# EAGLE design pcb_4 (EAGLE 4.16)
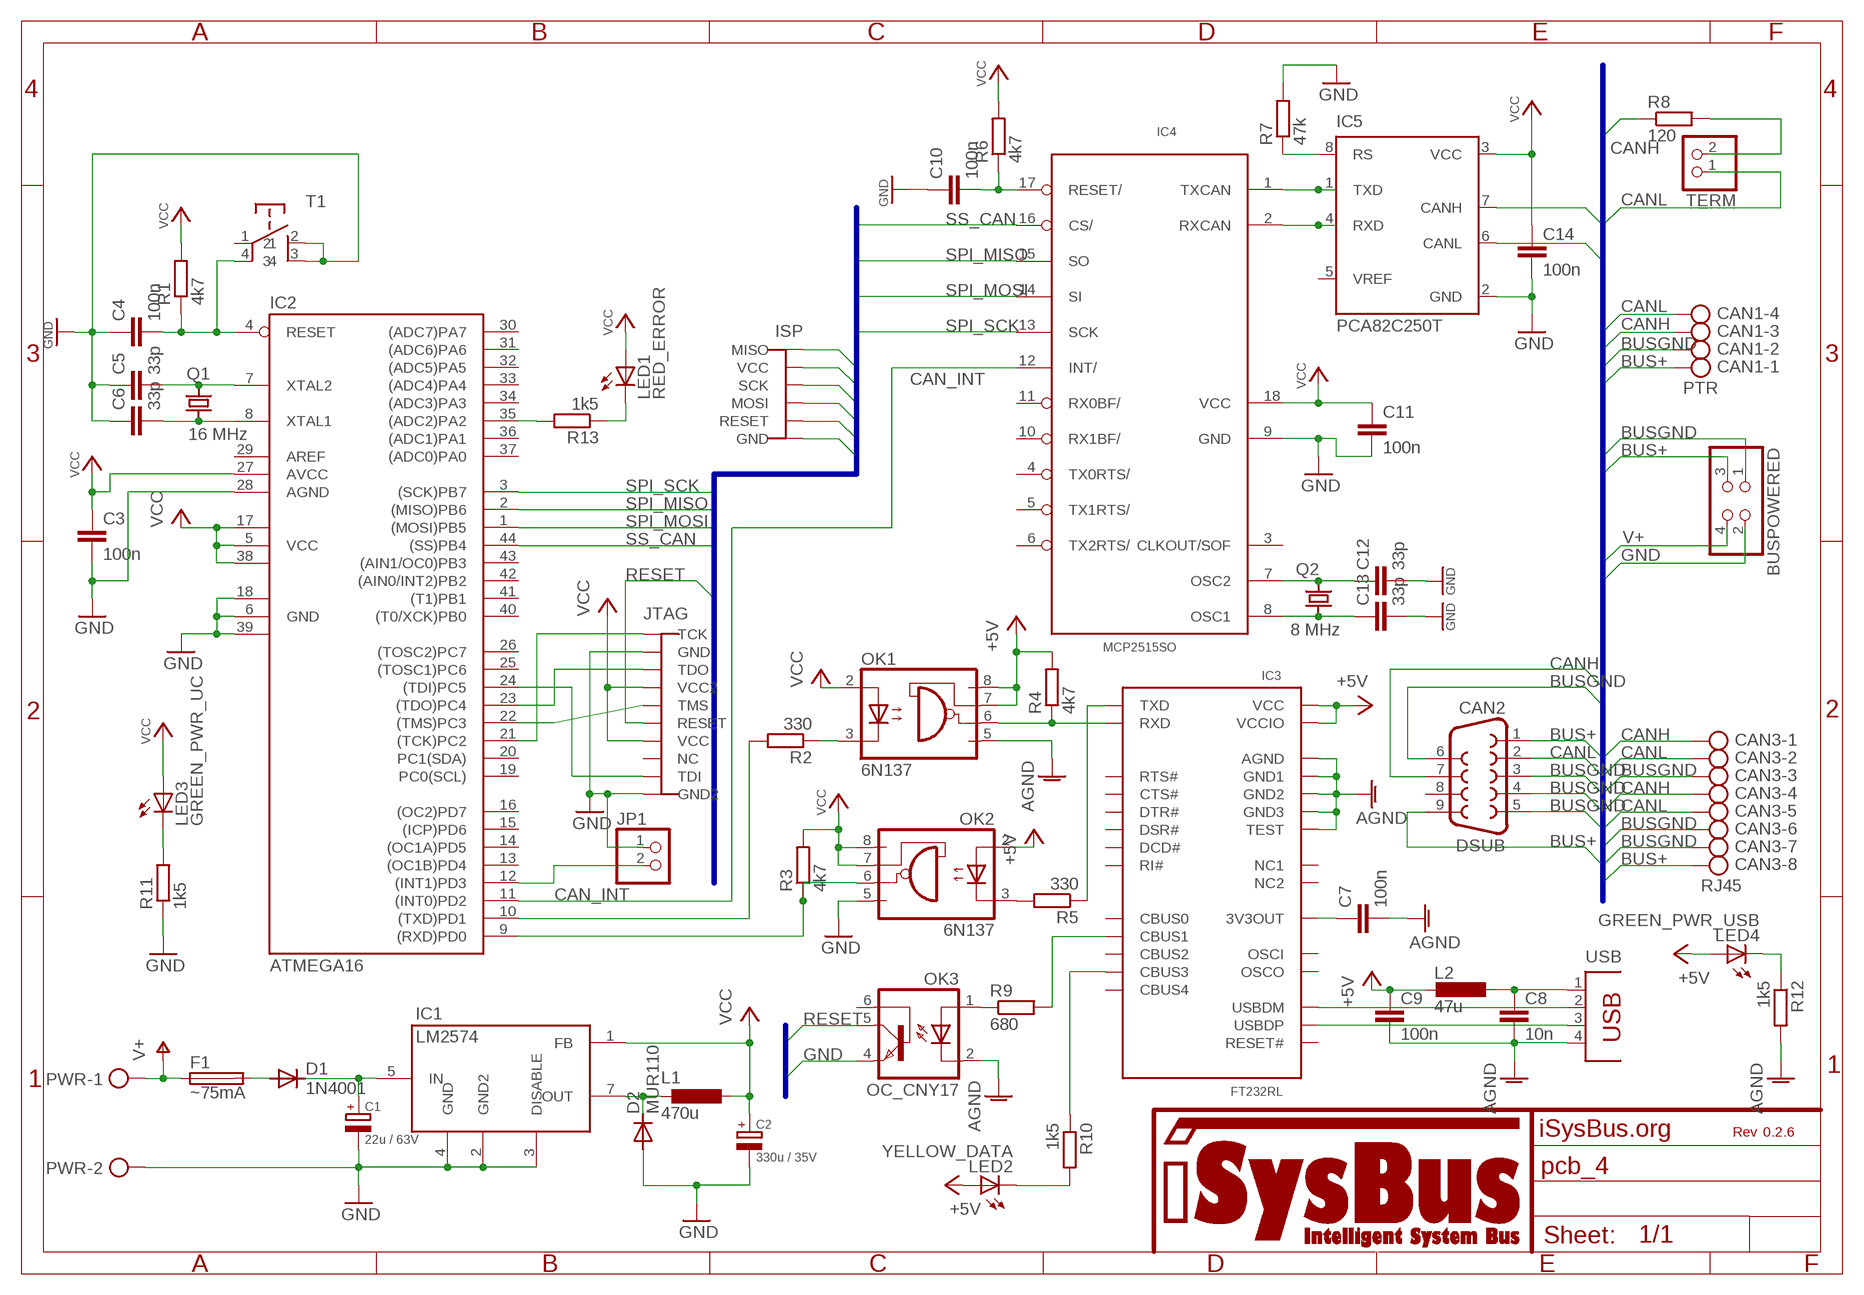
[diagram p0: schematic, sheet 1]

## Parts
BUSPOWERED  PINHD-2X2  [2X02]
C1  22u / 63V  C-IN-LM2574  [C-IN]
C2  330u / 35V  C-OUT-LM2574  [C-OUT]
C3  100n  C-EUC0805  [C0805]
C4  100n  C-EUC0805  [C0805]
C5  33p  C-EUC0805  [C0805]
C6  33p  C-EUC0805  [C0805]
C7  100n  C-EUC0805  [C0805]
C8  10n  C-EUC0805  [C0805]
C9  100n  C-EUC0805  [C0805]
C10  100n  C-EUC0805  [C0805]
C11  100n  C-EUC0805  [C0805]
C12  33p  C-EUC0805  [C0805]
C13  33p  C-EUC0805  [C0805]
C14  100n  C-EUC0805  [C0805]
CAN1  PTR  CON_AKL230-4  [AKL230-4]
CAN2  DSUB  F09HP  [F09HP]
CAN3  RJ45  CON_RJ45  [RJ45]
D1  1N4001  DIODE_1N4001  [DO41-10]
D2  MUR110  DIODE_MUR110  [DO41-10]
F1  ~75mA  FUSE_5MM  [19560]
IC1  LM2574  SUP_LM2574-DIL8  [DIL08]
IC2  ATMEGA16  UC_ATMEGA16-A  [TQFP44]
IC3  FT232RL  USB_FT232RL  [SSOP-28]
IC4  MCP2515SO  CAN_MCP2515SO  [SO18L]
IC5  PCA82C250T  CAN_PCA82C250T  [SO08N.PAC]
ISP  CON_ISP1  [057-006-1]
JP1  PIN1X2  [1X02]
JTAG  CON_JTAG1  [057-010-1]
L1  470u  L-LM2574  [L5-10]
L2  47u  L-EU0207/10  [0207/10]
LED1  RED_ERROR  LED3MM  [LED3MM]
LED2  YELLOW_DATA  LED3MM  [LED3MM]
LED3  GREEN_PWR_UC  LED3MM  [LED3MM]
LED4  GREEN_PWR_USB  LED3MM  [LED3MM]
OK1  6N137  OK_6N137  [DIL08@1]
OK2  6N137  OK_6N137  [DIL08@1]
OK3  OC_CNY17  [DIL06]
PWR  CON_AKL230-2  [AKL230-2]
Q1  16 MHz  CRYSTAL  [HC49U-V]
Q2  8 MHz  CRYSTAL  [HC49U-V]
R1  4k7  R-EU_R0805  [R0805]
R2  330  R-EU_R0805  [R0805]
R3  4k7  R-EU_R0805  [R0805]
R4  4k7  R-EU_R0805  [R0805]
R5  330  R-EU_R0805  [R0805]
R6  4k7  R-EU_R0805  [R0805]
R7  47k  R-EU_R0805  [R0805]
R8  120  R-EU_R0805  [R0805]
R9  680  R-EU_R0805  [R0805]
R10  1k5  R-EU_R0805  [R0805]
R11  1k5  R-EU_R0805  [R0805]
R12  1k5  R-EU_R0805  [R0805]
R13  1k5  R-EU_R0805  [R0805]
T1  SWITCH_PHAP3301  [PHAP3301]
TERM  PINHD-1X2  [1X02]
U$1  ISYSBUS_LOGO  [ISYSBUS_LOGO]
U$2  0.2.6  FIELD_REVISION_ISYSBUS  [FIELD_REVISION_ISYSBUS]
U$3  FIELD_NAME  [FIELD_NAME]
USB  CON_USB  [PN61729]

## Nets
+3V3: C9.1 IC3.P$4(VCCIO) IC3.P$20(VCC) L2.2 LED2.A LED4.A OK1.7(VE) OK1.8(VCC) OK2.2(A) R4.2 ; supply symbol labelled +5V
AGND: C7.2 C8.2 C9.2 IC3.P$7(GND1) IC3.P$18(GND2) IC3.P$21(GND3) IC3.P$25(AGND) IC3.P$26(TEST) OK1.5(GND) OK3.2(C) R12.2 USB.4
BUS+: BUSPOWERED.3 CAN1.1 CAN2.1 CAN2.9 CAN3.8
BUSGND: BUSPOWERED.1 CAN1.2 CAN2.3 CAN2.4 CAN2.5 CAN2.6 CAN3.3 CAN3.6 CAN3.7
CAN_INT: IC2.11((INT0)PD2) IC4.12(INT/)
CANH: CAN1.3 CAN2.7 CAN3.1 CAN3.4 IC5.7(CANH) R8.1
CANL: CAN1.4 CAN2.2 CAN3.2 CAN3.5 IC5.6(CANL) TERM.1
GND: BUSPOWERED.2 C1.- C2.- C3.2 C4.1 C5.1 C6.1 C10.1 C11.2 C12.2 C13.2 C14.2 D2.A IC1.2(GND2) IC1.3(DISABLE) IC1.4(GND) IC2.6(GND) IC2.18(GND1) IC2.28(AGND) IC2.39(GND2) IC4.9(GND) IC5.2(GND) ISP.6(GND) JP1.1 JTAG.2(GND) JTAG.10(GND2) OK2.5(GND) OK3.4(EMI) PWR.2 R7.2 R11.1 T1.2 T1.3
N$1: C7.1 IC3.P$17(3V3OUT)
N$2: C6.2 IC2.8(XTAL1) Q1.1
N$3: C5.2 IC2.7(XTAL2) Q1.2
N$4: C1.+ D1.C IC1.5(IN)
N$5: OK2.3(C) R5.2
N$6: OK1.3(C) R2.1
N$7: IC2.9((RXD)PD0) OK2.6(VO) R3.1
N$8: R8.2 TERM.2
N$9: C10.2 IC4.17(RESET/) R6.1
N$10: C12.1 IC4.7(OSC2) Q2.2
N$11: C13.1 IC4.8(OSC1) Q2.1
N$12: IC3.P$5(RXD) OK1.6(VO) R4.1
N$13: D1.A F1.2
N$14: IC5.8(RS) R7.1
N$15: IC3.P$22(CBUS1) R9.2
N$16: OK3.1(A) R9.1
N$17: IC2.35((ADC2)PA2) R13.2
N$18: LED1.K(C) R13.1
N$19: LED2.K(C) R10.2
N$20: IC3.P$14(CBUS3) R10.1
N$21: LED4.K(C) R12.1
N$22: LED3.K(C) R11.2
N$23: IC2.12((INT1)PD3) JP1.2
REG_OUT: D2.C IC1.7(OUT) L1.P$2
RESET: C4.2 IC2.4(RESET) ISP.5(RESET) JTAG.6(RESET) OK3.5(COL) R1.1 T1.4
RXCAN: IC4.1(TXCAN) IC5.1(TXD)
SPI_MISO: IC2.2((MISO)PB6) IC4.15(SO) ISP.1(MISO)
SPI_MOSI: IC2.1((MOSI)PB5) IC4.14(SI) ISP.4(MOSI)
SPI_SCK: IC2.3((SCK)PB7) IC4.13(SCK) ISP.3(SCK)
SS_CAN: IC2.44((SS)PB4) IC4.16(CS/)
TCK: IC2.21((TCK)PC2) JTAG.1(TCK)
TDI: IC2.24((TDI)PC5) JTAG.9(TDI)
TDO: IC2.23((TDO)PC4) JTAG.3(TDO)
TMS: IC2.22((TMS)PC3) JTAG.5(TMS)
TXCAN: IC4.2(RXCAN) IC5.4(RXD)
UART_RXD: IC3.P$1(TXD) R5.1
UART_TXD: IC2.10((TXD)PD1) R2.2
USB_1: C8.1 L2.1 USB.1
USB_DM: IC3.P$16(USBDM) USB.2
USB_DP: IC3.P$15(USBDP) USB.3
V+: BUSPOWERED.4 F1.1 PWR.1
VCC: C2.+ C3.1 C11.1 C14.1 IC1.1(FB) IC2.5(VCC) IC2.17(VCC1) IC2.27(AVCC) IC2.38(VCC2) IC4.18(VCC) IC5.3(VCC) ISP.2(VCC) JTAG.4(VCC2) JTAG.7(VCC) L1.P$1 LED1.A LED3.A OK1.2(A) OK2.7(VE) OK2.8(VCC) R1.2 R3.2 R6.2
Unconnected: CAN2.8 IC2.13((OC1B)PD4) IC2.14((OC1A)PD5) IC2.15((ICP)PD6) IC2.16((OC2)PD7) IC2.19(PC0(SCL)) IC2.20(PC1(SDA)) IC2.25((TOSC1)PC6) IC2.26((TOSC2)PC7) IC2.30((ADC7)PA7) IC2.31((ADC6)PA6) IC2.32((ADC5)PA5) IC2.33((ADC4)PA4) IC2.34((ADC3)PA3) IC2.36((ADC1)PA1) IC2.37((ADC0)PA0) IC2.40((T0/XCK)PB0) IC2.41((T1)PB1) IC2.42((AIN0/INT2)PB2) IC2.43((AIN1/OC0)PB3) IC3.P$2(DTR#) IC3.P$3(RTS#) IC3.P$6(RI#) IC3.P$8(NC1) IC3.P$9(DSR#) IC3.P$10(DCD#) IC3.P$11(CTS#) IC3.P$12(CBUS4) IC3.P$13(CBUS2) IC3.P$19(RESET#) IC3.P$23(CBUS0) IC3.P$24(NC2) IC3.P$27(OSCI) IC3.P$28(OSCO) IC4.3(CLKOUT/SOF) IC4.4(TX0RTS/) IC4.5(TX1RTS/) IC4.6(TX2RTS/) IC4.10(RX1BF/) IC4.11(RX0BF/) IC5.5(VREF) JTAG.8(NC) OK3.6(BAS) T1.1

## Buses
SPI_MISO,SPI_MOSI,SPI_SCK,SS_CAN,RESET,VCC,GND
CANH,CANL,V+,GND,BUS+,BUSGND
RESET,GND

## Power pins joined to a net without a drawn wire
AREF: IC2.29(AREF)

## Library data of the parts
BUSPOWERED = pinhead:PINHD-2X2: PIN HEADER
C1 = isysbus_passive:C-IN-LM2574: Capacitor: Input for LM2574 Order numbers: - Reichelt: RAD 22/63 - CSD-Electronics: ???
C2 = isysbus_passive:C-OUT-LM2574: Capacitor: Output for LM2574 Order numbers: - Reichelt: RAD 330/35 - CSD-Electronics: 1204
C3-C14 = rcl:C-EU: CAPACITOR, European symbol
CAN1 = isysbus_mechanical:CON_AKL230-4: Connector: AKL230-4 Order numbers: - Reichelt: AKL 230-04 - CSD-Electronics: N/A
CAN2 = con-subd:F09: SUB-D
CAN3 = isysbus_mechanical:CON_RJ45: Connector: 8pin RJ45 Order numbers: - Reichelt: MEBP 8-8G - CSD-Electronics: 015-5402
D1 = isysbus_active:DIODE_1N4001: Diode: 1N4001 Order numbers: - Reichelt: 1N 4001 - CSD-Electronics: 11001
D2 = isysbus_active:DIODE_MUR110: Diode: MUR110 Order numbers: - Reichelt: MUR 110 - CSD-Electronics: N/A
F1 = isysbus_mechanical:FUSE_5MM: Fuse holder Order numbers: - Reichelt: PL 166600 - CSD-Electronics: N/A
IC1 = isysbus_ics:SUP_LM2574: Voltage regulator: LM2574 Order numbers (DIP8): - Reichelt: LM 2574 N5 - CSD-Electronics: N/A Order numbers (SO14WM): - Reichelt: N/A - CSD-Electronics: N/A
IC2 = isysbus_ics:UC_ATMEGA16: Microcontroller: ATmega16 Order numbers (TQFP44): - Reichelt: ATMEGA 16-16 TQ - CSD-Electronics: 30139
IC3 = isysbus_ics:USB_FT232RL: USB-USART adapter: FT232RL Order numbers (SSOP28): - Reichelt: FT 232 RL - CSD-Electronics: N/A
IC4 = isysbus_ics:CAN_MCP2515*: CAN-Controller: MCP2515 Order numbers (DIP18): - Reichelt: MCP 2515-I/P - CSD-Electronics: N/A Order numbers (SO18): - Reichelt: MCP 2515-I/SO - CSD-Electronics: N/A
IC5 = isysbus_ics:CAN_PCA82C250: CAN-Transceiver: PCA82C250 / MCP2551 Order numbers (DIP8): - Reichelt: PCA 82C250 - CSD-Electronics: N/A Order numbers (SO8): - Reichelt: PCA 82C250 T - CSD-Electronics: N/A
ISP = isysbus_mechanical:CON_ISP: Connector: ISP Order numbers: - Reichelt: N/A - CSD-Electronics: N/A
JP1 = isysbus_mechanical:PIN1X2: PIN HEADER
JTAG = isysbus_mechanical:CON_JTAG: Connector: JTAG Order numbers: - Reichelt: WSL 10G - CSD-Electronics: 01550
L1 = isysbus_passive:L-LM2574: Inductor: for LM2574 Order numbers: - Reichelt: 09P 470µ - CSD-Electronics: ???
L2 = rcl:L-EU: INDUCTOR, European symbol
LED1-LED4 = led:LED: LED OSRAM: - CHIPLED LG R971, LG N971, LY N971, LG Q971, LY Q971, LO R971, LY R971 LH N974, LH R974 LS Q976, LO Q976, LY Q976 LO Q996 - Hyper CHIPLED LW Q18S LB Q993, LB Q99A, LB R99A - SideLED LS A670, LO A670, LY A670, LG A670, LP A670 LB A673, LV A673, LT A673, LW A673 LH A674 LY A675 LS A676, LA A676, LO A676, LY A676, LW A676 LS A679, LY A679, LG A679 - Hyper Micro SIDELED® LS Y876, LA Y876, LO Y876, LY Y876 LT Y87S - SmartLED LW L88C, LW L88S LB L89C, LB L89S, LG L890 LS L89K, LO L89K, LY L89K LS L896, LA L896, LO L896, LY L896 - TOPLED LS T670, LO T670, LY T670, LG T670, LP T670 LSG T670, LSP T670, LSY T670, LOP T670, LYG T670 LG T671, LOG T671, LSG T671 LB T673, LV T673, LT T673, LW T673 LH T674 LS T676, LA T676, LO T676, LY T676, LB T676, LH T676, LSB T676, LW T676 LB T67C, LV T67C, LT T67C, LS T67K, LO T67K, LY T67K, LW E67C LS E67B, LA E67B, LO E67B, LY E67B, LB E67C, LV E67C, LT E67C LW T67C LS T679, LY T679, LG T679 LS T770, LO T770, LY T770, LG T770, LP T770 LB T773, LV T773, LT T773, LW T773 LH T774 LS E675, LA E675, LY E675, LS T675 LS T776, LA T776, LO T776, LY T776, LB T776 LHGB T686 LT T68C, LB T68C - Hyper Mini TOPLED® LB M676 - Mini TOPLED Santana® LG M470 LS M47K, LO M47K, LY M47K Source: http://www.osram.convergy.de - LUMILED® LXK2-PW12-R00, LXK2-PW12-S00, LXK2-PW14-U00, LXK2-PW14-V00 LXK2-PM12-R00, LXK2-PM12-S00, LXK2-PM14-U00 LXK2-PE12-Q00, LXK2-PE12-R00, LXK2-PE12-S00, LXK2-PE14-T00, LXK2-PE14-U00 LXK2-PB12-K00, LXK2-PB12-L00, LXK2-PB12-M00, LXK2-PB14-N00, LXK2-PB14-P00, LXK2-PB14-Q00 LXK2-PR12-L00, LXK2-PR12-M00, LXK2-PR14-Q00, LXK2-PR14-R00 LXK2-PD12-Q00, LXK2-PD12-R00, LXK2-PD12-S00 LXK2-PH12-R00, LXK2-PH12-S00 LXK2-PL12-P00, LXK2-PL12-Q00, LXK2-PL12-R00 Source: www.luxeon.com
OK1 OK2 = isysbus_ics:OK_6N137: MOTOROLA OPTO COUPLER
OK3 = isysbus_ics:OC_CNY17: Optocoupler: CNY17 Order numbers (DIP6): - Reichelt: CNY 17/I - CSD-Electronics: 13117
PWR = isysbus_mechanical:CON_AKL230-2: Connector: AKL230-2 Order numbers: - Reichelt: AKL 230-02 - CSD-Electronics: N/A
Q1 Q2 = isysbus_passive:CRYSTAL: Crystal: HC49U
R1-R13 = rcl:R-EU_: RESISTOR, European symbol
T1 = isysbus_mechanical:SWITCH_PHAP3301: Switch: PHAP3301 Order numbers: - Reichelt: TASTER 3301 - CSD-Electronics: ? 35102 ?
TERM = pinhead:PINHD-1X2: PIN HEADER
U$1 = isysbus_misc:ISYSBUS_LOGO: iSysBus Logo
U$2 = isysbus_misc:FIELD_REVISION_ISYSBUS
U$3 = isysbus_misc:FIELD_NAME
USB = isysbus_mechanical:CON_USB: Connector: USB Type B Order numbers: - Reichelt: USB BW - CSD-Electronics: 1575

## Board
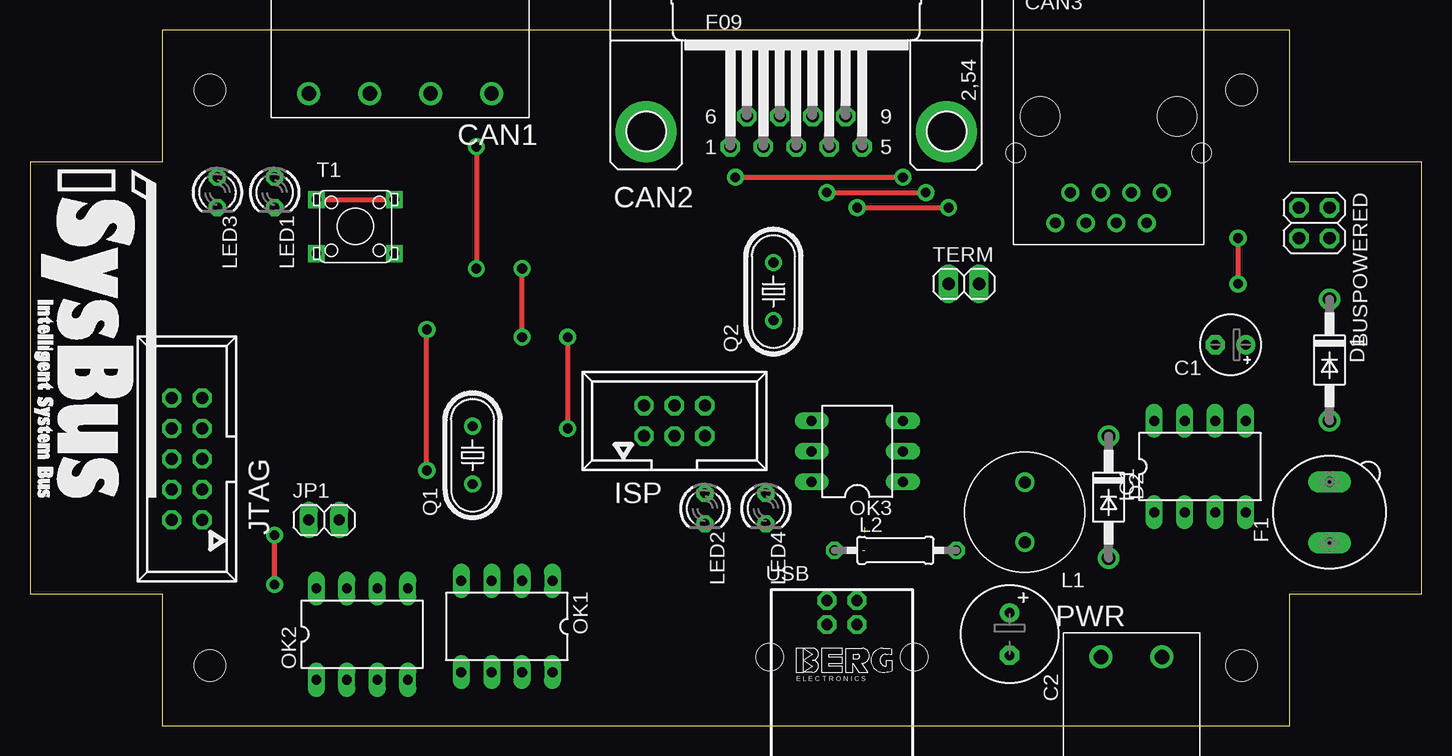
[diagram p1: board, top side]
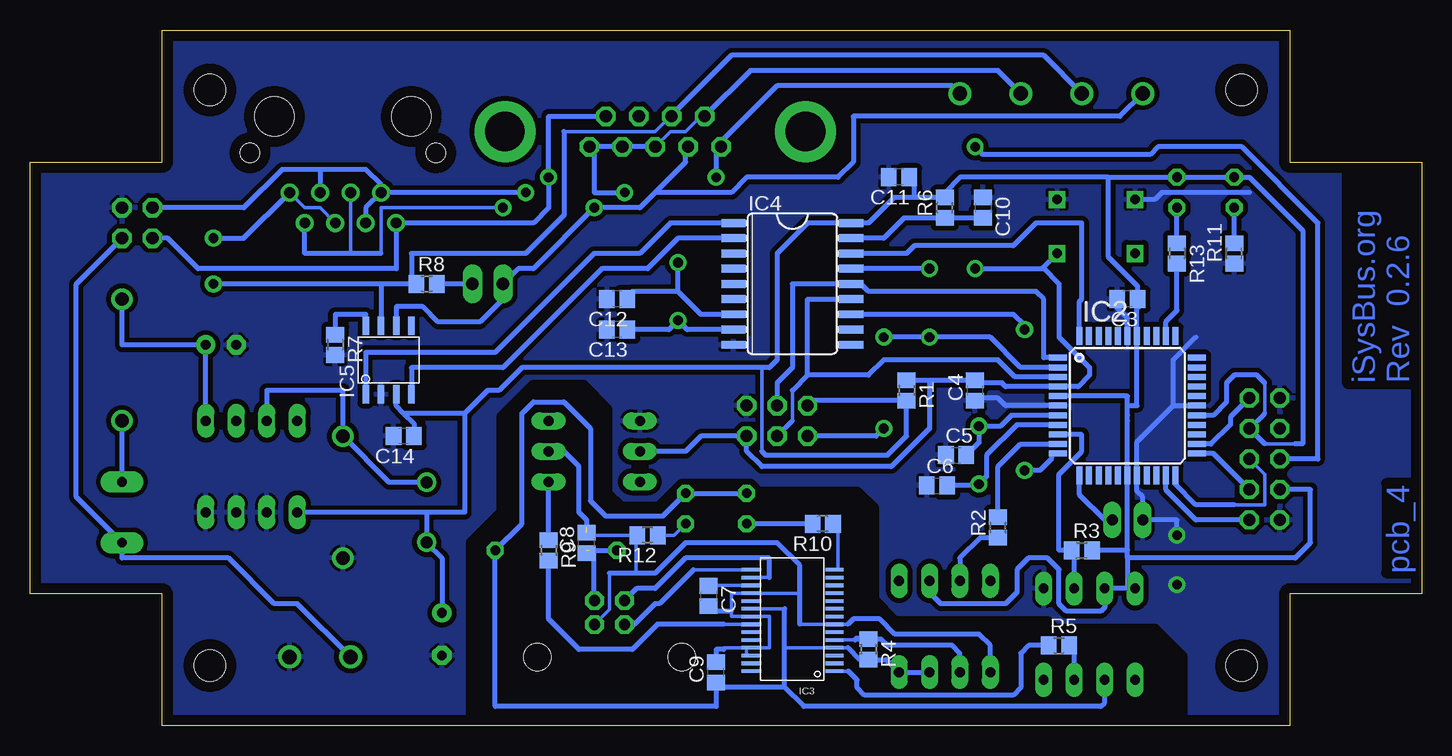
[diagram p2: board, bottom side, seen from below]

Size 116 x 58 mm. Coordinates in mm from the lower left corner, seen from the top.
Outline: 0,11 11,11 11,0 105,0 105,11 116,11 116,47 105,47 105,58 11,58 11,47 0,47 0,11
Copper layers (1*16): Top 0.035mm / dielectric 1.5mm / Bottom 0.035mm
Design rules "hausbus": minimum track width 12mil, minimum drill 31mil, track to track 10mil, track to pad 10mil, pad to pad 10mil, via to via 10mil, smd to smd 8mil, copper to edge 35mil, drill to drill 8mil, minimum pad ring 12mil, minimum via ring 12mil, stop-mask expansion 4mil, vias tented up to drill 0mil, thermal gap 10mil
Holes 2.6 mm at 15,5 15,53 101,53 101,5
bRestrict: 21 lines

### Footprints (pad centres in the part's own frame; a part is rotated, then mirrored left to right if it is on the bottom)
2X02 = drill 1.016 octagon: 1 -1.27,-1.27; 2 -1.27,1.27; 3 1.27,-1.27; 4 1.27,1.27
C-IN = drill 0.813 pad 1.6 round: + -1.27,0 | drill 0.813 pad 1.6 octagon: - 1.27,0
C-OUT = drill 0.813 pad 1.6 round: + -1.778,0 | drill 0.813 pad 1.6 octagon: - 1.778,0
C0805 = smd 1.3 x 1.5: 1 -0.85,0; 2 0.85,0
AKL230-4 = drill 1.2 round: 1 -7.62,0; 2 -2.54,0; 3 2.54,0; 4 7.62,0
F09HP = drill 1.016 octagon: 1 -5.486,-1.27; 2 -2.743,-1.27; 3 0,-1.27; 4 2.743,-1.27; 5 5.486,-1.27; 6 -4.115,1.27; 7 -1.372,1.27; 8 1.372,1.27; 9 4.115,1.27 | drill 3.302 pad 5.08 round: G1 -12.522,0; G2 12.522,0
RJ45 = drill 0.9 round: 1 3.81,-6.35; 2 2.54,-8.89; 3 1.27,-6.35; 4 0,-8.89; 5 -1.27,-6.35; 6 -2.54,-8.89; 7 -3.81,-6.35; 8 -5.08,-8.89 | hole 3.25: -6.35,0; 5.08,0 | hole 1.6: 7.11,-3.05; -8.38,-3.05
DO41-10 = drill 1.118 round: A 5.08,0; C -5.08,0
19560 = drill 0.813 pad 1.778 long: 1 -2.54,0; 2 2.54,0
DIL08 = drill 0.813 long: 1 -3.81,-3.81; 2 -1.27,-3.81; 3 1.27,-3.81; 4 3.81,-3.81; 5 3.81,3.81; 6 1.27,3.81; 7 -1.27,3.81; 8 -3.81,3.81
TQFP44 = smd 1.5 x 0.5: 1 -5.8,4; 2 -5.8,3.2; 3 -5.8,2.4; 4 -5.8,1.6; 5 -5.8,0.8; 6 -5.8,0; 7 -5.8,-0.8; 8 -5.8,-1.6; 9 -5.8,-2.4; 10 -5.8,-3.2; 11 -5.8,-4; 23 5.8,-4; 24 5.8,-3.2; 25 5.8,-2.4; 26 5.8,-1.6; 27 5.8,-0.8; 28 5.8,0; 29 5.8,0.8; 30 5.8,1.6; 31 5.8,2.4; 32 5.8,3.2; 33 5.8,4 | smd 0.5 x 1.5: 12 -4,-5.8; 13 -3.2,-5.8; 14 -2.4,-5.8; 15 -1.6,-5.8; 16 -0.8,-5.8; 17 0,-5.8; 18 0.8,-5.8; 19 1.6,-5.8; 20 2.4,-5.8; 21 3.2,-5.8; 22 4,-5.8; 34 4,5.8; 35 3.2,5.8; 36 2.4,5.8; 37 1.6,5.8; 38 0.8,5.8; 39 0,5.8; 40 -0.8,5.8; 41 -1.6,5.8; 42 -2.4,5.8; 43 -3.2,5.8; 44 -4,5.8
SSOP-28 = smd 1.5 x 0.3: P$1 -3.5,4.35; P$2 -3.5,3.7; P$3 -3.5,3.05; P$4 -3.5,2.4; P$5 -3.5,1.75; P$6 -3.5,1.1; P$7 -3.5,0.45; P$8 -3.5,-0.2; P$9 -3.5,-0.85; P$10 -3.5,-1.5; P$11 -3.5,-2.15; P$12 -3.5,-2.8; P$13 -3.5,-3.45; P$14 -3.5,-4.1; P$15 3.5,-4.1; P$16 3.5,-3.45; P$17 3.5,-2.8; P$18 3.5,-2.15; P$19 3.5,-1.5; P$20 3.5,-0.85; P$21 3.5,-0.2; P$22 3.5,0.45; P$23 3.5,1.1; P$24 3.5,1.75; P$25 3.5,2.4; P$26 3.5,3.05; P$27 3.5,3.7; P$28 3.5,4.35
SO18L = smd 0.66 x 2.032: 1 -5.08,-4.902; 2 -3.81,-4.902; 3 -2.54,-4.902; 4 -1.27,-4.902; 5 0,-4.902; 6 1.27,-4.902; 7 2.54,-4.902; 8 3.81,-4.902; 9 5.08,-4.902; 10 5.08,4.902; 11 3.81,4.902; 12 2.54,4.902; 13 1.27,4.902; 14 0,4.902; 15 -1.27,4.902; 16 -2.54,4.902; 17 -3.81,4.902; 18 -5.08,4.902
SO08N.PAC = smd 0.559 x 1.524: 1 -1.905,-2.223; 2 -0.635,-2.223; 3 0.635,-2.223; 4 1.905,-2.223; 5 1.905,3.493; 6 0.635,3.493; 7 -0.635,3.493; 8 -1.905,3.493
057-006-1 = drill 1 octagon: 1 -2.54,-1.27; 2 -2.54,1.27; 3 0,-1.27; 4 0,1.27; 5 2.54,-1.27; 6 2.54,1.27
1X02 = drill 0.9 long: 1 -1.27,0; 2 1.27,0
057-010-1 = drill 1 octagon: 1 -5.08,-1.27; 2 -5.08,1.27; 3 -2.54,-1.27; 4 -2.54,1.27; 5 0,-1.27; 6 0,1.27; 7 2.54,-1.27; 8 2.54,1.27; 9 5.08,-1.27; 10 5.08,1.27
L5-10 = drill 1 round: P$1 0,2.5; P$2 0,-2.5
0207/10 = drill 0.813 octagon: 1 -5.08,0; 2 5.08,0
LED3MM = drill 0.813 octagon: A -1.27,0; K 1.27,0
DIL08@1 = drill 0.813 long: 1 -3.81,-3.81; 2 -1.27,-3.81; 3 1.27,-3.81; 4 3.81,-3.81; 5 3.81,3.81; 6 1.27,3.81; 7 -1.27,3.81; 8 -3.81,3.81
DIL06 = drill 0.813 long: 1 -2.54,-3.81; 2 0,-3.81; 3 2.54,-3.81; 4 2.54,3.81; 5 0,3.81; 6 -2.54,3.81
AKL230-2 = drill 1.2 round: 1 -2.54,0; 2 2.54,0
HC49U-V = drill 0.813 round: 1 -2.413,0; 2 2.413,0
R0805 = smd 1.3 x 1.5: 1 -0.85,0; 2 0.85,0
PHAP3301 = drill 0.8 square: 1 0,0; 2 0,4.5; 3 6.5,4.5; 4 6.5,0
1X02' = drill 1.016 long: 1 -1.27,0; 2 1.27,0
PN61729 = drill 0.95 octagon: 1 1.25,4.71; 2 -1.25,4.71; 3 -1.25,2.71; 4 1.25,2.71 | hole 2.3: -6.02,0; 6.02,0

### Placement (x,y rotation side)
BUSPOWERED  107.06,41.91 270 top
C1  100.08,31.75 180 top
C2  81.66,7.62 270 top
C3  24.51,35.56 180 bottom
C4  37.21,27.94 90 bottom
C5  38.8,22.54 0 bottom
C6  40.38,20 0 bottom
C7  59.44,10.79 270 bottom
C8  69.59,15.24 90 bottom
C9  58.8,4.45 90 bottom
C10  36.58,43.18 270 bottom
C11  43.56,45.72 180 bottom
C12  67.06,35.56 180 bottom
C13  67.06,33.02 180 bottom
C14  84.83,24.13 180 bottom
CAN1  30.86,52.7 180 top
CAN2  63.88,49.53 0 top
CAN3  90.55,50.8 0 top
D1  108.33,30.48 270 top
D2  89.92,19.05 270 top
F1  108.33,17.78 90 top
IC1  97.53,21.59 0 top
IC2  24.51,26.67 0 bottom
IC3  52.45,8.89 180 bottom
IC4  52.45,36.83 270 bottom
IC5  86.11,29.84 0 bottom
ISP  53.72,25.4 0 top
JP1  24.51,17.14 0 top
JTAG  13.08,22.23 90 top
L1  82.93,17.78 180 top
L2  72.14,14.61 0 top
LED1  20.38,44.45 270 top
LED2  56.26,18.1 270 top
LED3  15.62,44.45 270 top
LED4  61.34,18.1 270 top
OK1  39.75,8.26 180 top
OK2  27.68,7.62 0 top
OK3  68.96,22.86 90 top
PWR  91.82,5.71 0 top
Q1  36.89,22.54 90 top
Q2  61.98,36.2 90 top
R1  42.92,27.94 270 bottom
R2  35.3,16.51 90 bottom
R3  28.32,14.61 0 bottom
R4  46.1,6.35 270 bottom
R5  30.23,6.67 0 bottom
R6  39.75,43.18 90 bottom
R7  90.55,31.75 270 bottom
R8  82.93,36.83 0 bottom
R9  72.77,14.61 270 bottom
R10  49.91,16.83 180 bottom
R11  15.62,39.37 90 bottom
R12  64.52,15.88 180 bottom
R13  20.38,39.37 270 bottom
T1  23.88,39.37 0 top
TERM  [1X02']  77.85,36.83 0 top
U$1  0.38,46.35 270 top
U$2  1.01,28.57 90 bottom
U$3  1.01,12.7 90 bottom
USB  67.69,5.71 0 top

### Tracks (layer width: path | path; a pad name or v marks a point on that pad's centre or on a via)
+3V3
  Bottom 0.305: 53.09,6.49 IC3.P$4 47.83,6.49 | 53.09,9.74 IC3.P$20
  Bottom 0.406: 53.09,9.74 53.09,6.49 53.09,3.17 | 53.09,3.17 58.8,3.17 | 58.8,3.17 58.8,1.59 77.22,1.59 L2.2 74.99,16.83 74.99,26.04 74.04,26.99 71.5,26.99 69.28,24.77 69.28,18.73 68.01,17.46 63.24,17.46 LED4.A LED2.A | 58.8,3.17 C9.1 | OK1.7 OK1.8 44.62,5.5 R4.2 46.84,5.5 47.83,6.49 | OK2.2 26.41,1.91 26.73,1.59 51.5,1.59 53.09,3.17
AGND  (1 unrouted)
  Bottom 0.305: 51.81,11.04 IC3.P$18 57.53,11.04 57.53,9.53 57.53,9.09 IC3.P$21 54.35,9.09 54.35,6.49 IC3.P$25 | IC3.P$25 58.16,6.49 58.16,6.35 | IC3.P$25 56.26,6.49 56.26,5.84 IC3.P$26 | 51.81,8.44 IC3.P$7 47.82,8.44 | USB.4 67.69,9.68 67.69,12.7 | 65.47,12.7 65.47,15.77 R12.2 69.38,15.88 C8.2
  Bottom 0.406: 58.16,6.35 58.8,6.35 C9.2 | 51.81,8.44 51.81,11.04 51.81,13.34 53.72,15.24 61.34,15.24 63.88,12.7 65.47,12.7 67.69,12.7 | C7.2 59.02,9.53 57.53,9.53 | 47.82,8.44 47.37,8.89 45.15,8.89 43.88,7.62 36.89,7.62 35.94,6.67 OK1.5 | 69.59,16.51 69.59,17.14 70.23,17.78 70.23,21.59 71.5,22.86 OK3.2
BUS+  (via drill 0.8)
  Top 0.406: v58.8,45.72 v72.77,45.72
  Bottom 0.406: BUSPOWERED.3 104.52,40.64 101.98,38.1 85.47,38.1 CAN3.8 74.04,41.91 72.77,43.18 v72.77,45.72 72.77,50.8 CAN2.9 67.69,50.8 | 58.8,48.26 CAN2.1 | 58.8,48.26 v58.8,45.72 | 58.8,48.26 53.72,53.34 39.11,53.34 CAN1.1
BUSGND  (via drill 0.81)
  Top 0.406: v66.42,44.45 v74.67,44.45
  Bottom 0.305: CAN2.3 62.61,49.53 61.34,49.53 60.07,50.8
  Bottom 0.406: 68.96,48.26 CAN2.4 CAN2.3 | 68.96,48.26 CAN2.5 | 91.82,46.35 CAN3.3 | 91.82,46.35 88.01,46.35 86.74,45.09 CAN3.7 | BUSPOWERED.1 98.17,43.18 95,46.35 91.82,46.35 | v74.67,44.45 CAN3.7 | 68.96,48.26 68.96,44.45 v66.42,44.45 | CAN1.2 35.3,54.61 55.95,54.61 CAN2.6 60.07,50.8 | CAN3.7 88.01,43.18 CAN3.6
CAN_INT  (via drill 0.81)
  Top 0.406: v33.08,21.27 v33.08,33.02
  Bottom 0.406: IC2.11 30.86,22.67 30.86,22.23 31.81,21.27 v33.08,21.27 | v33.08,33.02 33.08,33.34 34.03,34.29 IC4.12
CANH  (via drill 0.81)
  Top 0.406: v100.71,36.83 v100.71,40.64
  Bottom 0.305: 62.51,50.9 CAN2.7 | 62.61,50.8 63.88,49.53 71.5,49.53 | CAN3.1 93.09,43.18 91.82,43.18 CAN3.4
  Bottom 0.406: 62.51,50.9 57.53,55.88 31.5,55.88 CAN1.3 | CAN2.7 62.61,50.8 | 71.5,49.53 71.5,42.55 74.67,39.37 84.2,39.37 84.2,36.83 | 84.2,36.83 R8.1 | 84.2,36.83 86.74,36.83 | CAN3.1 98.17,40.64 v100.71,40.64 | 86.74,36.83 v100.71,36.83 | 86.74,36.83 IC5.7
CANL  (via drill 0.81)
  Top 0.406: v68.96,43.18 v76.58,43.18
  Bottom 0.305: 89.28,39.37 CAN3.5 | 86.74,39.37 86.74,43.18 v76.58,43.18
  Bottom 0.406: CAN3.2 93.09,39.37 89.28,39.37 86.74,39.37 | 63.88,44.45 61.34,46.99 61.34,48.26 CAN2.2 60.7,48.26 | 63.88,44.45 65.15,43.18 v68.96,43.18 74.04,38.1 75.31,38.1 TERM.1 76.58,35.56 78.48,33.66 81.98,33.66 83.25,34.92 85.47,34.92 IC5.6 85.47,33.02 | CAN1.4 25.14,50.8 47.37,50.8 47.37,46.99 48.64,45.72 56.26,45.72 57.53,44.45 63.88,44.45
GND  (via drill 0.8)
  Top 0.406: 30.49,43.87 T1.3 | T1.2 30.49,43.87 | 30.49,43.87 30.54,43.81 | v20.38,11.75 v20.38,15.88
  Bottom 0.406: IC2.6 34.67,26.67 35.3,27.3 37.21,27.3 C4.1 | 18.8,26.67 IC2.28 20.7,26.67 | 20.7,26.67 20.7,30.48 18.8,32.38 | 20.7,26.67 23.71,23.66 IC2.18 23.71,19.52 23.24,19.05 JP1.1 20.38,17.14 v20.38,15.88 | IC2.39 24.51,33.97 25.36,34.82 C3.2 | 14.35,44.45 21.65,44.45 22.23,43.87 T1.2
  pour Bottom (isolate 0.406): 0,11 0,47 11,47 11,58 105,58 105,47 116,47 116,11 105,11 105,0 11,0 11,11
N$1
  Bottom 0.305: C7.1 59.44,11.43 59.17,11.69 IC3.P$17
N$2
  Bottom 0.406: IC2.8 33.73,25.07 36.26,22.54 36.26,20.77 Q1.1 37.02,20 C6.2
N$3
  Bottom 0.406: IC2.7 34.2,25.87 35.11,24.96 Q1.2 36.89,23.6 C5.2
N$4
  Bottom 0.406: D1.C 108.33,31.75 C1.+ IC1.5
N$5
  Bottom 0.406: R5.2 28.95,6.25 OK2.3
N$6
  Bottom 0.406: R2.1 36.79,15.66 38.48,13.97 OK1.3
N$7
  Bottom 0.406: IC2.9 28.32,24.27 28.32,22.86 30.23,20.95 30.23,14.61 R3.1 28.95,14.39 OK2.6
N$8
  Bottom 0.406: TERM.2 R8.2
N$9
  Bottom 0.406: C10.2 R6.1 43.14,42.33 44.83,40.64 IC4.17
N$10
  Bottom 0.406: 61.98,36.2 Q2.2 | 61.98,36.2 60.07,34.29 IC4.7 | C12.1 66.42,35.56 65.78,36.2 61.98,36.2
N$11
  Bottom 0.406: IC4.8 61.21,33.02 Q2.1 62.74,33.02 C13.1 66.42,33.02
N$12
  Bottom 0.305: 47.22,7.14 IC3.P$5
  Bottom 0.406: 47.22,7.14 47.05,7.3 46.95,7.2 R4.1 45.05,7.2 44.51,6.67 39.11,6.67 38.48,6.03 OK1.6
N$13
  Bottom 0.406: F1.2 D1.A
N$14
  Bottom 0.406: IC5.8 88.01,34.29 90.55,34.29 R7.1
N$15
  Bottom 0.305: IC3.P$22 58.16,8.44
  Bottom 0.406: R9.2 72.77,8.89 70.23,6.35 65.78,6.35 63.7,8.44 58.16,8.44
N$16
  Bottom 0.406: R9.1 OK3.1
N$17
  Bottom 0.406: IC2.35 21.31,33.68 20.38,34.61 R13.2
N$18
  Bottom 0.406: R13.1 LED1.K
N$19
  Bottom 0.406: R10.2 LED2.K
N$20
  Bottom 0.305: IC3.P$14 48.64,12.99 48.64,16.83 R10.1
N$21
  Bottom 0.305: R12.1 62.29,15.88 LED4.K
N$22
  Bottom 0.406: R11.2 LED3.K
N$23
  Bottom 0.406: IC2.12 28.51,19.24 26.41,17.14 JP1.2
REG_OUT
  Bottom 0.406: IC1.7 96.27,27.94 89.92,27.94 D2.C 86.06,20.28 L1.P$2
RESET  (via drill 0.8)
  Top 0.406: v37.21,48.26 v37.21,38.1
  Bottom 0.406: JTAG.6 8.63,22.23 8.63,41.91 14.98,48.26 21.97,48.26 22.61,47.62 36.58,47.62 v37.21,48.26 | 41.02,28.79 C4.2 37.21,28.57 34.98,28.57 34.67,28.27 IC2.4 28.62,28.27 27.68,29.21 27.68,29.84 30.23,32.38 30.23,36.83 31.57,38.17 | 41.02,28.79 R1.1 42.92,28.57 | 41.02,28.79 41.02,24.77 44.2,21.59 54.99,21.59 56.26,22.86 ISP.5 60.07,24.13 61.34,22.86 OK3.5 | 31.57,38.17 31.64,38.1 v37.21,38.1 | 31.57,38.17 T1.4
RXCAN
  Bottom 0.406: IC4.1 62.61,41.91 65.15,39.37 68.96,39.37 77.22,31.11 88.01,31.11 IC5.1
SPI_MISO  (via drill 0.81)
  Top 0.406: v41.02,32.38 v41.02,38.1 | v44.83,32.38 v44.83,24.77
  Bottom 0.406: IC2.2 33.42,29.87 35.94,32.38 v41.02,32.38 v44.83,32.38 | ISP.1 45.47,24.13 v44.83,24.77 | v41.02,38.1 IC4.15
SPI_MOSI
  Bottom 0.406: ISP.4 53.72,28.57 52.45,29.84 52.45,36.83 IC4.14 46.73,36.83 46.1,36.2 32.13,36.2 31.5,35.56 31.5,30.67 IC2.1
SPI_SCK
  Bottom 0.305: 52.45,27.94 52.45,25.4
  Bottom 0.406: IC2.3 33.89,29.07 35.3,30.48 44.83,30.48 46.1,29.21 51.18,29.21 | 52.45,25.4 ISP.3 | IC4.13 51.18,35.56 51.18,29.21 | 51.18,29.21 52.45,27.94
SS_CAN
  Bottom 0.406: IC4.16 42.92,39.37 42.29,40.01 34.03,40.01 32.13,41.91 28.32,41.91 28.32,35.56 28.51,35.37 IC2.44
TCK
  Bottom 0.406: IC2.21 21.31,19.66 18.8,17.14 JTAG.1
TDI
  Bottom 0.406: IC2.24 17.55,23.47 15.94,25.08 15.94,25.72 JTAG.9
TDO
  Bottom 0.406: IC2.23 17.34,22.67 JTAG.3
TMS
  Bottom 0.305: 15.62,18.41 13.08,18.41 13.08,20.95 JTAG.5
  Bottom 0.406: IC2.22 20.51,20.13 18.8,18.41 15.62,18.41
TXCAN
  Bottom 0.406: IC4.2 61.98,40.64 64.52,38.1 68.33,38.1 76.58,29.84 84.2,29.84 IC5.4
UART_RXD
  Bottom 0.305: 47.78,4.54 IC3.P$1
  Bottom 0.406: R5.1 32.77,6.67 33.4,6.03 33.4,3.17 34.03,2.54 46.42,2.54 47.05,3.17 47.05,3.81 47.78,4.54
UART_TXD
  Bottom 0.406: IC2.10 33.42,23.47 35.3,21.59 R2.2
USB_1  (1 unrouted)
  Bottom 0.406: 69.59,14.61 | 69.59,14.61 69.59,14.62 | C8.1 69.59,14.61 | 68.96,14.61 L2.1 | 68.96,14.61 69.38,14.61 | USB.1 68.96,10.45 68.96,14.61
USB_DM
  Bottom 0.305: IC3.P$16 54.35,12.34
  Bottom 0.406: 54.35,12.34 54.35,13.97 61.34,13.97 63.88,11.43 65.44,11.43 USB.2
USB_DP
  Bottom 0.305: IC3.P$15 60.7,12.99
  Bottom 0.406: 60.7,12.99 63.53,10.16 63.88,10.16 65.62,8.43 USB.3
V+
  Bottom 0.406: PWR.1 93.72,10.16 95.63,10.16 99.44,13.97 108.33,13.97 F1.1 112.14,19.05 112.14,36.83 BUSPOWERED.4
VCC
  Bottom 0.305: 54.99,29.84 54.99,22.86 | 10.54,23.5 13.08,23.5 | 13.08,26.04 13.08,28.57
  Bottom 0.406: 82.93,17.78 79.75,17.78 79.75,26.04 | C11.1 42.29,45.72 42.29,44.03 | 42.29,44.03 R6.2 39.75,44.45 38.48,45.72 26.1,45.72 | 24.51,25.4 IC2.17 24.51,14.61 | 24.51,25.4 24.51,26.67 | 24.51,25.4 24.51,25.87 | 24.51,26.67 23.71,26.67 IC2.38 23.71,34.77 23.56,34.92 23.66,35.03 C3.1 23.66,36.62 26.1,39.05 26.1,45.72 | IC2.5 24.51,27.47 24.51,26.67 | 54.99,22.86 54.67,22.54 44.51,22.54 42.92,24.13 R1.2 50.76,27.09 ISP.2 | 82.93,17.78 L1.P$1 82.93,15.24 81.66,13.97 C2.+ | 82.93,17.78 IC1.1 | 85.47,27.94 IC5.3 85.47,26.67 84.83,26.04 | 24.51,13.97 24.51,14.61 | JTAG.4 9.27,19.68 9.27,15.24 10.54,13.97 24.51,13.97 | 13.08,23.5 JTAG.7 13.08,26.04 | C14.1 83.98,25.18 84.83,26.04 | 79.75,26.04 84.83,26.04 | 79.75,26.04 77.85,27.94 76.9,27.94 74.99,29.84 54.99,29.84 54.35,29.84 53.72,30.48 53.72,39.37 51.18,41.91 IC4.18 46.1,41.91 43.98,44.03 42.29,44.03 | 10.54,23.5 9.9,23.5 9.9,41.27 14.35,45.72 LED3.A LED1.A 26.1,45.72 | 24.51,11.43 OK2.8 | 24.51,11.43 OK2.7 26.41,9.84 26.73,9.53 29.59,9.53 30.23,10.16 30.23,13.02 31.18,13.97 32.77,13.97 33.72,13.02 33.72,11.11 34.67,10.16 40.07,10.16 41.02,11.11 OK1.2 | 24.51,14.61 R3.2 | 24.51,13.97 24.51,11.43 | IC2.27 17.37,25.87 16.26,26.99 16.26,28.57 15.62,29.21 13.71,29.21 13.08,28.57

### Text on the board
tDocu: CAN | CAN | RESET | CAN | PWR | BUS_PWR | ERROR | TERM | ISP | DATA | PWR | JTAG | PWR | USB